# EAGLE design XTIDE-CPLD-5V-v1b (EAGLE 5.07)
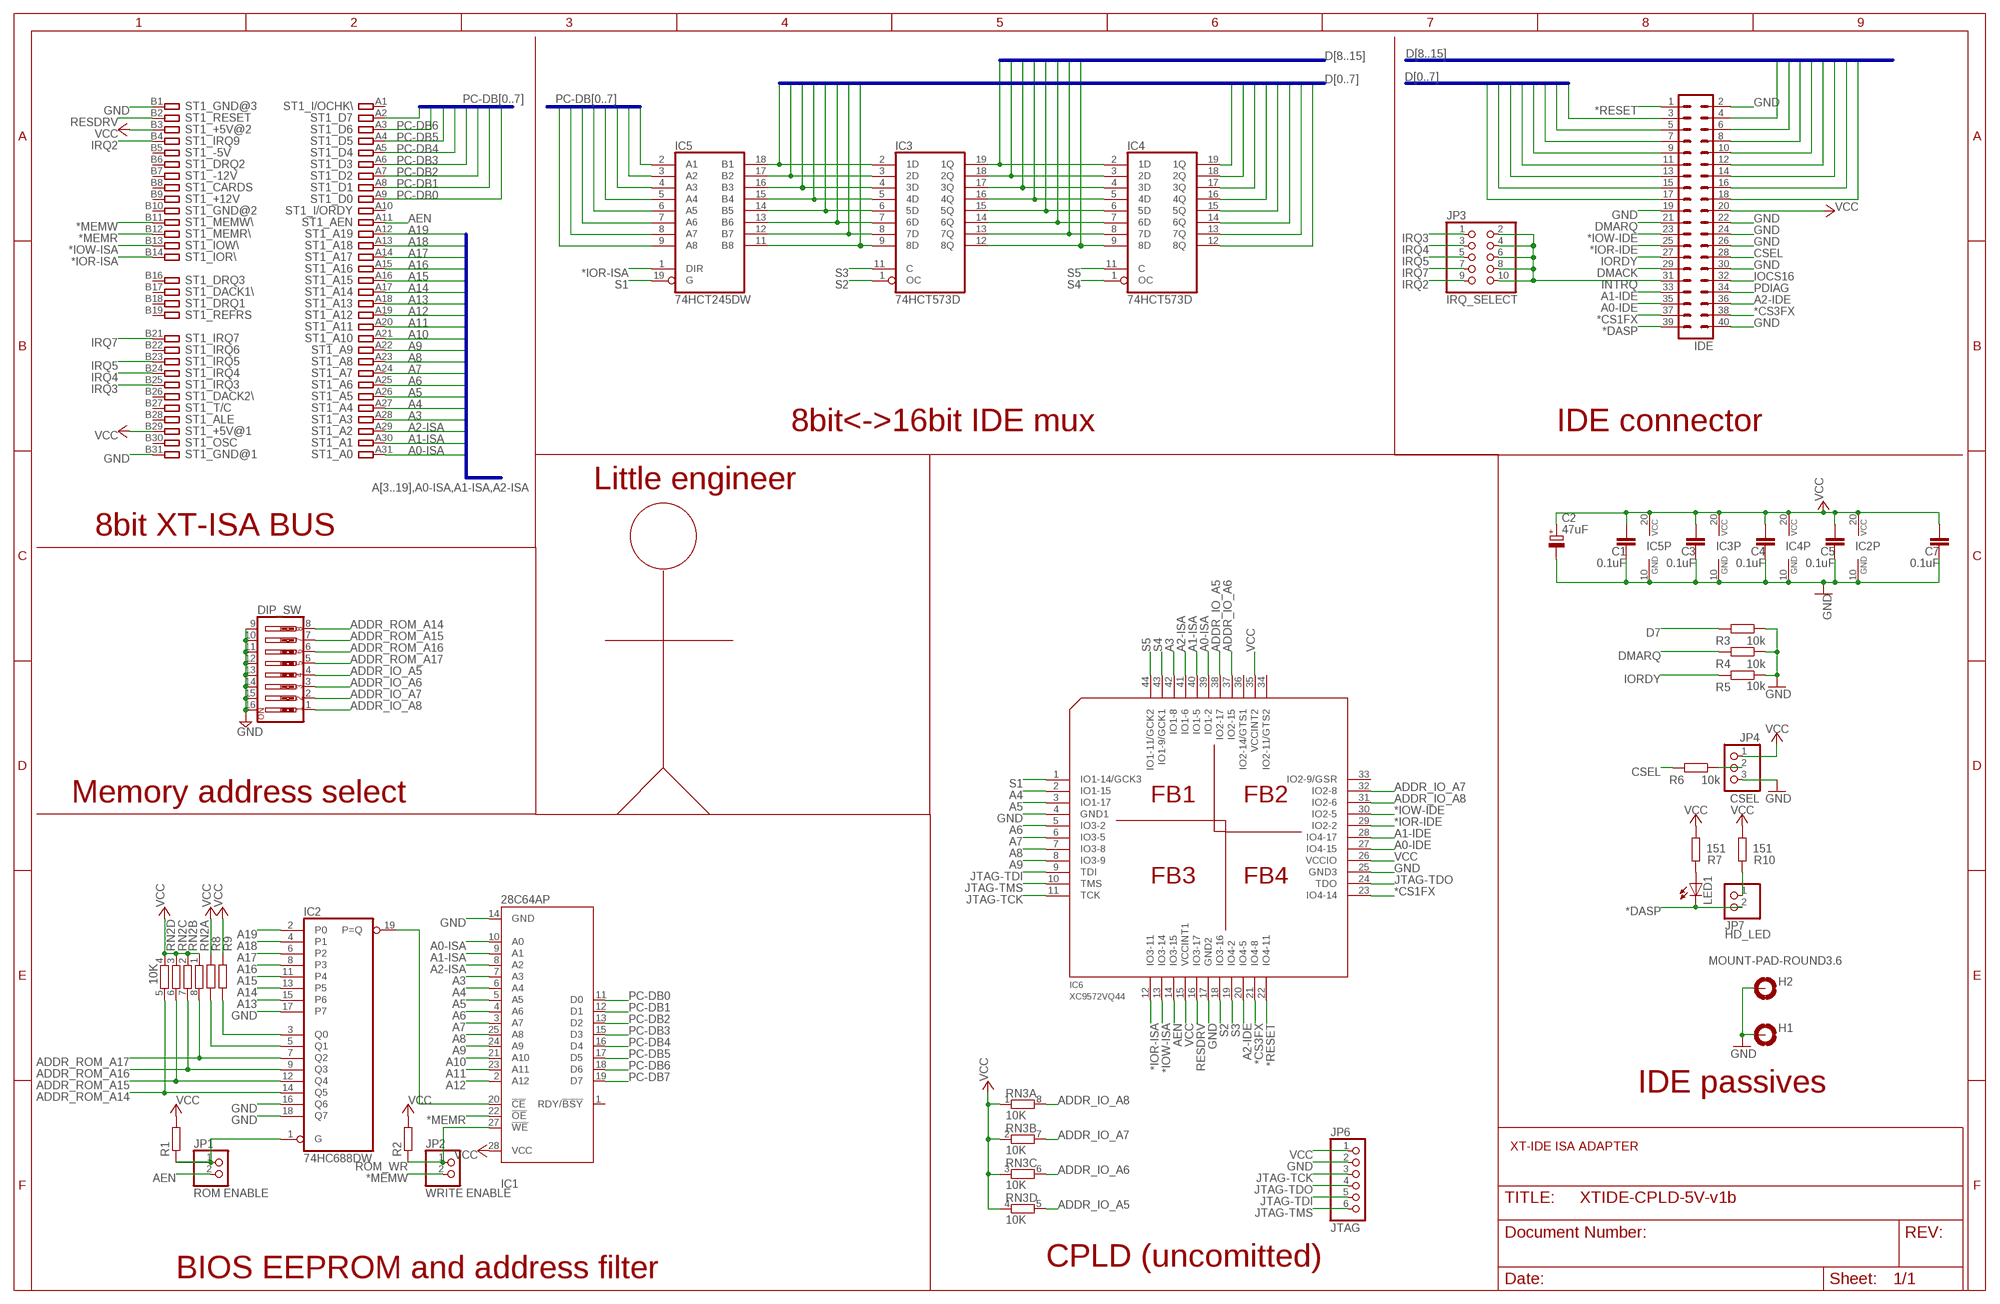
[diagram p0: schematic, sheet 1]

## Parts
C1  0.1uF  C-EUC0603  [C0603]
C2  47uF  CPOL-EUSANYO_SMD_A5  [SANYO-OSCON_SMD_A5]
C3  0.1uF  C-EUC0603  [C0603]
C4  0.1uF  C-EUC0603  [C0603]
C5  0.1uF  C-EUC0603  [C0603]
C7  0.1uF  C-EUC0603  [C0603]
DIP_SW  SW_DIP-8  [EDG-08]
H1  MOUNT-PAD-ROUND3.6  [3,6-PAD]
H2  MOUNT-PAD-ROUND3.6  [3,6-PAD]
IC1  28C64AP  [DIL28-6]
IC2  74HC688DW  [SO20W]
IC3  74HCT573D  [SO20W]
IC4  74HCT573D  [SO20W]
IC5  74HCT245DW  [SO20W]
IC6  XC9572VQ44  [VQ44]
IDE  MA20-2  [MA20-2]
JP1  ROM ENABLE  PINHD-1X02_2.54-S  [1X02-S]
JP2  WRITE ENABLE  PINHD-1X02_2.54-S  [1X02-S]
JP3  IRQ_SELECT  PINHD-2X05_2.54  [2X05]
JP4  CSEL  PINHD-1X03_2.54-S  [1X03-S]
JP6  JTAG  PINHD-1X06_2.54-S  [1X06-S]
JP7  HD_LED  PINHD-1X02_2.54-S  [1X02-S]
LED1  LEDCHIPLED_0805  [CHIPLED_0805]
R1  R-EU_R0603  [R0603]
R2  R-EU_R0603  [R0603]
R3  10k  R-EU_R0603  [R0603]
R4  10k  R-EU_R0603  [R0603]
R5  10k  R-EU_R0603  [R0603]
R6  10k  R-EU_R0603  [R0603]
R7  151  R-EU_R0603  [R0603]
R8  R-EU_R0603  [R0603]
R9  R-EU_R0603  [R0603]
R10  151  R-EU_R0603  [R0603]
RN2  10K  RNETWORK  [RN8P-4R-CRA06S]
RN3  10K  RNETWORK  [RN8P-4R-CRA06S]
ST1  IBM8BIT  [IBM8BIT]

## Nets
*CS1FX: IC6.23(IO4-14) IDE.37
*CS3FX: IC6.21(IO4-8) IDE.38
*DASP: IDE.39 JP7.2 LED1.C
*IOR-IDE: IC6.29(IO2-2) IDE.25
*IOR-ISA: IC5.1(DIR) IC6.12(IO3-11) ST1.B14
*IOW-IDE: IC6.30(IO2-5) IDE.23
*IOW-ISA: IC6.13(IO3-14) ST1.B13
*MEMR: IC1.22(!OE) ST1.B12
*MEMW: JP2.2 ST1.B11
*RESET: IC6.22(IO4-11) IDE.1
A0-IDE: IC6.27(IO4-15) IDE.35
A0-ISA: IC1.10(A0) IC6.39(IO1-2) ST1.A31
A1-IDE: IC6.28(IO4-17) IDE.33
A1-ISA: IC1.9(A1) IC6.40(IO1-5) ST1.A30
A2-IDE: IC6.20(IO4-5) IDE.36
A2-ISA: IC1.8(A2) IC6.41(IO1-6) ST1.A29
A3: IC1.7(A3) IC6.42(IO1-8) ST1.A28
A4: IC1.6(A4) IC6.2(IO1-15) ST1.A27
A5: IC1.5(A5) IC6.3(IO1-17) ST1.A26
A6: IC1.4(A6) IC6.5(IO3-2) ST1.A25
A7: IC1.3(A7) IC6.6(IO3-5) ST1.A24
A8: IC1.25(A8) IC6.7(IO3-8) ST1.A23
A9: IC1.24(A9) IC6.8(IO3-9) ST1.A22
A10: IC1.21(A10) ST1.A21
A11: IC1.23(A11) ST1.A20
A12: IC1.2(A12) ST1.A19
A13: IC2.15(P6) ST1.A18
A14: IC2.13(P5) ST1.A17
A15: IC2.11(P4) ST1.A16
A16: IC2.8(P3) ST1.A15
A17: IC2.6(P2) ST1.A14
A18: IC2.4(P1) ST1.A13
A19: IC2.2(P0) ST1.A12
ADDR_IO_A5: DIP_SW.4 IC6.38(IO2-17) RN3.5
ADDR_IO_A6: DIP_SW.3 IC6.37(IO2-15) RN3.6
ADDR_IO_A7: DIP_SW.2 IC6.32(IO2-8) RN3.7
ADDR_IO_A8: DIP_SW.1 IC6.31(IO2-6) RN3.8
ADDR_ROM_A14: DIP_SW.8 IC2.14(Q5) RN2.5
ADDR_ROM_A15: DIP_SW.7 IC2.12(Q4) RN2.6
ADDR_ROM_A16: DIP_SW.6 IC2.9(Q3) RN2.7
ADDR_ROM_A17: DIP_SW.5 IC2.7(Q2) RN2.8
AEN: IC6.14(IO3-15) JP1.2 ST1.A11
CSEL: IDE.28 R6.2
D0: IC3.2(1D) IC4.19(1Q) IC5.18(B1) IDE.17
D1: IC3.3(2D) IC4.18(2Q) IC5.17(B2) IDE.15
D2: IC3.4(3D) IC4.17(3Q) IC5.16(B3) IDE.13
D3: IC3.5(4D) IC4.16(4Q) IC5.15(B4) IDE.11
D4: IC3.6(5D) IC4.15(5Q) IC5.14(B5) IDE.9
D5: IC3.7(6D) IC4.14(6Q) IC5.13(B6) IDE.7
D6: IC3.8(7D) IC4.13(7Q) IC5.12(B7) IDE.5
D7: IC3.9(8D) IC4.12(8Q) IC5.11(B8) IDE.3 R3.2
D8: IC3.19(1Q) IC4.2(1D) IDE.4
D9: IC3.18(2Q) IC4.3(2D) IDE.6
D10: IC3.17(3Q) IC4.4(3D) IDE.8
D11: IC3.16(4Q) IC4.5(4D) IDE.10
D12: IC3.15(5Q) IC4.6(5D) IDE.12
D13: IC3.14(6Q) IC4.7(6D) IDE.14
D14: IC3.13(7Q) IC4.8(7D) IDE.16
D15: IC3.12(8Q) IC4.9(8D) IDE.18
DMACK: IDE.29
DMARQ: IDE.21 R4.2
GND: C1.1 C2.- C3.1 C4.1 C5.1 C7.1 DIP_SW.9 DIP_SW.10 DIP_SW.11 DIP_SW.12 DIP_SW.13 DIP_SW.14 DIP_SW.15 DIP_SW.16 H1.B3,6(MOUNT) H2.B3,6(MOUNT) IC1.14(GND) IC2.10(GND) IC2.16(Q6) IC2.17(P7) IC2.18(Q7) IC3.10(GND) IC4.10(GND) IC5.10(GND) IC6.4(GND1) IC6.17(GND2) IC6.25(GND3) IDE.2 IDE.19 IDE.22 IDE.24 IDE.26 IDE.30 IDE.40 JP4.3 JP6.2 R3.1 R4.1 R5.1 ST1.B1 ST1.B31
INTRQ: IDE.31 JP3.2 JP3.4 JP3.6 JP3.8 JP3.10
IOCS16: IDE.32
IORDY: IDE.27 R5.2
IRQ2: JP3.9 ST1.B4
IRQ3: JP3.1 ST1.B25
IRQ4: JP3.3 ST1.B24
IRQ5: JP3.5 ST1.B23
IRQ7: JP3.7 ST1.B21
JTAG-TCK: IC6.11(TCK) JP6.3
JTAG-TDI: IC6.9(TDI) JP6.5
JTAG-TDO: IC6.24(TDO) JP6.4
JTAG-TMS: IC6.10(TMS) JP6.6
N$1: IC2.1(G) JP1.1 R1.1
N$2: IC2.3(Q0) R9.1
N$3: IC2.5(Q1) R8.1
N$4: JP4.2 R6.1
N$5: LED1.A R7.2
N$6: JP7.1 R10.2
PC-DB0: IC1.11(D0) IC5.2(A1) ST1.A9
PC-DB1: IC1.12(D1) IC5.3(A2) ST1.A8
PC-DB2: IC1.13(D2) IC5.4(A3) ST1.A7
PC-DB3: IC1.15(D3) IC5.5(A4) ST1.A6
PC-DB4: IC1.16(D4) IC5.6(A5) ST1.A5
PC-DB5: IC1.17(D5) IC5.7(A6) ST1.A4
PC-DB6: IC1.18(D6) IC5.8(A7) ST1.A3
PC-DB7: IC1.19(D7) IC5.9(A8) ST1.A2
PDIAG: IDE.34
RESDRV: IC6.16(IO3-17) ST1.B2
ROM_CS: IC1.20(!CE) IC2.19(P=Q)
ROM_WR: IC1.27(!WE) JP2.1 R2.1
S1: IC5.19(G) IC6.1(IO1-14/GCK3)
S2: IC3.1(OC) IC6.18(IO3-16)
S3: IC3.11(C) IC6.19(IO4-2)
S4: IC4.1(OC) IC6.43(IO1-9/GCK1)
S5: IC4.11(C) IC6.44(IO1-11/GCK2)
VCC: C1.2 C2.+ C3.2 C4.2 C5.2 C7.2 IC1.28(VCC) IC2.20(VCC) IC3.20(VCC) IC4.20(VCC) IC5.20(VCC) IC6.15(VCCINT1) IC6.26(VCCIO) IC6.35(VCCINT2) IDE.20 JP4.1 JP6.1 R1.2 R2.2 R7.1 R8.2 R9.2 R10.1 RN2.1 RN2.2 RN2.3 RN2.4 RN3.1 RN3.2 RN3.3 RN3.4 ST1.B3 ST1.B29
Unconnected: IC1.1(RDY/!BSY) IC6.33(IO2-9/GSR) IC6.34(IO2-11/GTS2) IC6.36(IO2-14/GTS1) ST1.A1 ST1.A10 ST1.B5 ST1.B6 ST1.B7 ST1.B8 ST1.B9 ST1.B10 ST1.B15 ST1.B16 ST1.B17 ST1.B18 ST1.B19 ST1.B20 ST1.B22 ST1.B26 ST1.B27 ST1.B28 ST1.B30

## Buses
D[0..7]
D[8..15]
PC-DB[0..7]
A[3..19],A0-ISA,A1-ISA,A2-ISA

## Notes on the sheet
- 8bit<->16bit IDE mux | IDE connector
- Little engineer
- 8bit XT-ISA BUS
- Memory address select
- IDE passives
- XT-IDE ISA ADAPTER
- CPLD (uncomitted)
- BIOS EEPROM and address filter

## Library data of the parts
C1 C3-C5 C7 = rcl:C-EU: CAPACITOR, European symbol
C2 = rcl:CPOL-EU: POLARIZED CAPACITOR, European symbol
DIP_SW = special:SW_DIP-8: DIP SWITCH
H1 H2 = holes:MOUNT-PAD-ROUND: MOUNTING PAD, round
IC1 = microchip:28*64A: CMOS EEPROM 64 K (8 K x 8), low voltage
IC2 = 74xx-eu:74*688: 8-bit MAGNITUDE/IDENTITY COMPARATOR, totem pole
IC3 IC4 = 74xx-eu:74*573: 8-bit D latch BUS DRIVER
IC5 = 74xx-eu:74*245: Octal BUS TRANSCEIVER, 3-state
IC6 = dp_devices:XC9572
IDE = con-lstb:MA20-2: PIN HEADER
JP1 JP2 JP7 = pinhead-2:PINHD-1X02: PIN HEADER
JP3 = pinhead-2:PINHD-2X05: PIN HEADER
JP4 = pinhead-2:PINHD-1X03: PIN HEADER
JP6 = pinhead-2:PINHD-1X06: PIN HEADER
LED1 = led:LED: LED OSRAM: - CHIPLED LG R971, LG N971, LY N971, LG Q971, LY Q971, LO R971, LY R971 LH N974, LH R974 LS Q976, LO Q976, LY Q976 LO Q996 - Hyper CHIPLED LW Q18S LB Q993, LB Q99A, LB R99A - SideLED LS A670, LO A670, LY A670, LG A670, LP A670 LB A673, LV A673, LT A673, LW A673 LH A674 LY A675 LS A676, LA A676, LO A676, LY A676, LW A676 LS A679, LY A679, LG A679 - Hyper Micro SIDELED® LS Y876, LA Y876, LO Y876, LY Y876 LT Y87S - SmartLED LW L88C, LW L88S LB L89C, LB L89S, LG L890 LS L89K, LO L89K, LY L89K LS L896, LA L896, LO L896, LY L896 - TOPLED LS T670, LO T670, LY T670, LG T670, LP T670 LSG T670, LSP T670, LSY T670, LOP T670, LYG T670 LG T671, LOG T671, LSG T671 LB T673, LV T673, LT T673, LW T673 LH T674 LS T676, LA T676, LO T676, LY T676, LB T676, LH T676, LSB T676, LW T676 LB T67C, LV T67C, LT T67C, LS T67K, LO T67K, LY T67K, LW E67C LS E67B, LA E67B, LO E67B, LY E67B, LB E67C, LV E67C, LT E67C LW T67C LS T679, LY T679, LG T679 LS T770, LO T770, LY T770, LG T770, LP T770 LB T773, LV T773, LT T773, LW T773 LH T774 LS E675, LA E675, LY E675, LS T675 LS T776, LA T776, LO T776, LY T776, LB T776 LHGB T686 LT T68C, LB T68C - Hyper Mini TOPLED® LB M676 - Mini TOPLED Santana® LG M470 LS M47K, LO M47K, LY M47K Source: http://www.osram.convergy.de LUXEON: - LUMILED® LXK2-PW12-R00, LXK2-PW12-S00, LXK2-PW14-U00, LXK2-PW14-V00 LXK2-PM12-R00, LXK2-PM12-S00, LXK2-PM14-U00 LXK2-PE12-Q00, LXK2-PE12-R00, LXK2-PE12-S00, LXK2-PE14-T00, LXK2-PE14-U00 LXK2-PB12-K00, LXK2-PB12-L00, LXK2-PB12-M00, LXK2-PB14-N00, LXK2-PB14-P00, LXK2-PB14-Q00 LXK2-PR12-L00, LXK2-PR12-M00, LXK2-PR14-Q00, LXK2-PR14-R00 LXK2-PD12-Q00, LXK2-PD12-R00, LXK2-PD12-S00 LXK2-PH12-R00, LXK2-PH12-S00 LXK2-PL12-P00, LXK2-PL12-Q00, LXK2-PL12-R00 Source: www.luxeon.com KINGBRIGHT: KA-3528ASYC Source: www.kingbright.com
R1-R10 = rcl:R-EU_: RESISTOR, European symbol
RN2 RN3 = dp_devices:RNETWORK: 4 Resistor Array 0603
ST1 = con-pc:IBM8BIT: 8-bit CARD IBM/PC-AT

## Board
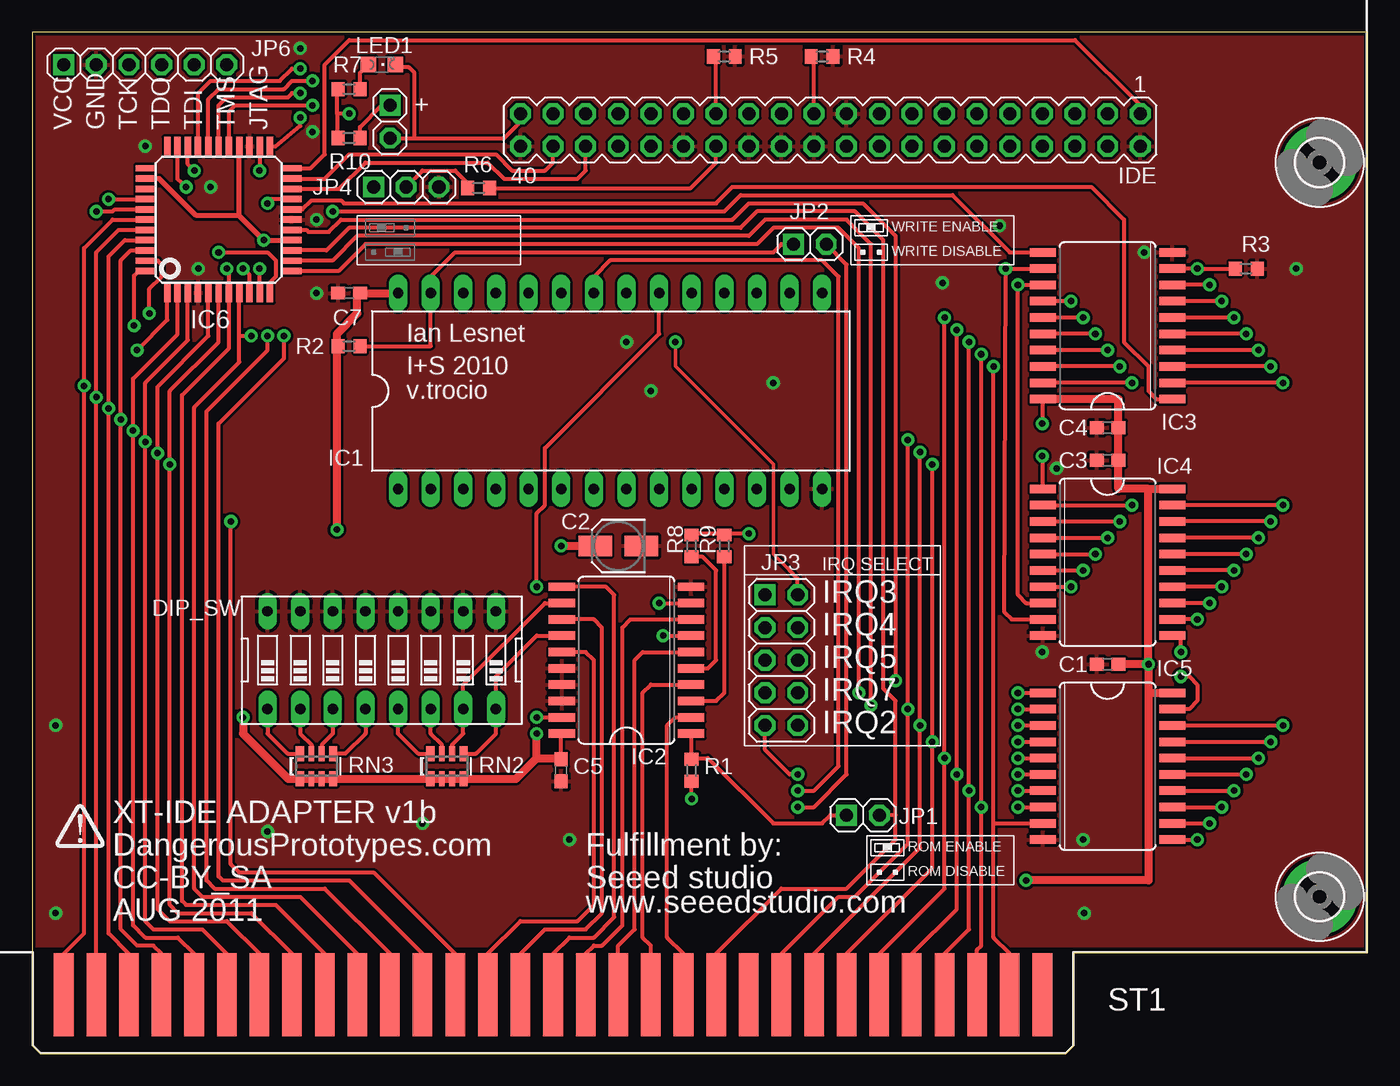
[diagram p1: board, top side]
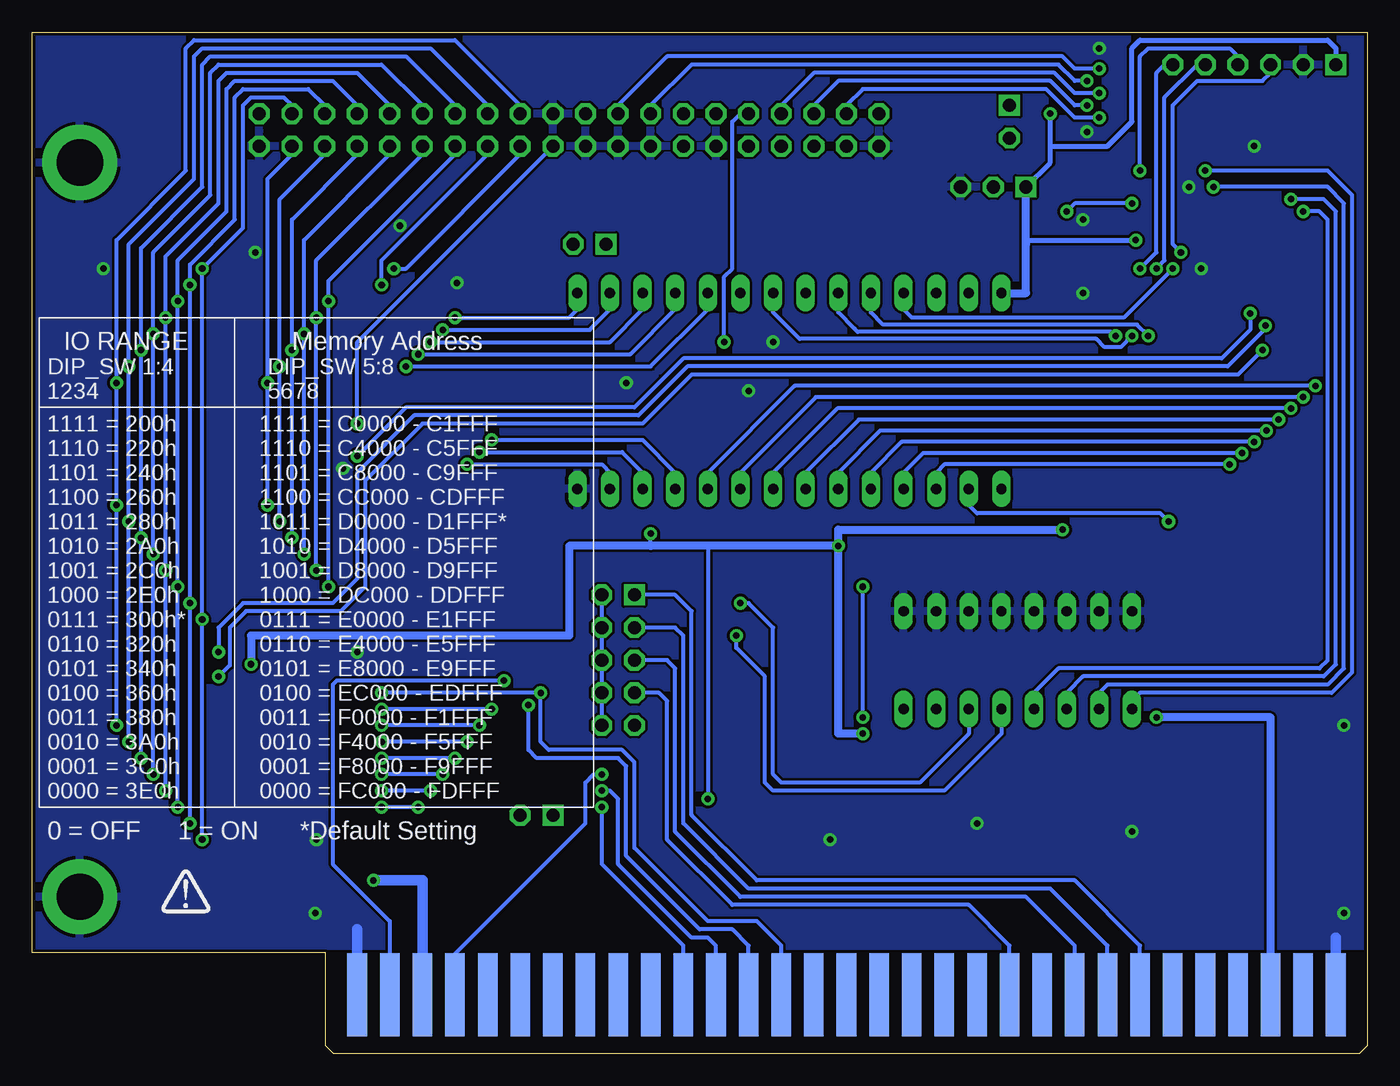
[diagram p2: board, bottom side, seen from below]

Size 103.97 x 79.52 mm. Coordinates in mm from the lower left corner, seen from the top.
Outline: 0,0.79 0,0.63 0.63,0 80.49,0 81.12,0.63 81.12,7.86 103.97,7.86 103.97,79.52 0,79.52 0,0.79
Copper layers (1*16): Top 0.035mm / dielectric 1.5mm / Bottom 0.035mm
Design rules "SparkFun": minimum track width 8mil, minimum drill 20mil, track to track 8mil, track to pad 8mil, pad to pad 8mil, via to via 8mil, smd to smd 8mil, copper to edge 10mil, drill to drill 8mil, minimum pad ring 12mil, minimum via ring 10mil, stop-mask expansion 4mil, vias tented up to drill 25mil, thermal gap 10mil

### Footprints (pad centres in the part's own frame; a part is rotated, then mirrored left to right if it is on the bottom)
C0603 = smd 1.1 x 1: 1 -0.85,0; 2 0.85,0
SANYO-OSCON_SMD_A5 = smd 2.6 x 1.6: + 1.8,0; - -1.8,0
EDG-08 = drill 0.813 long: 1 -8.89,-3.81; 2 -6.35,-3.81; 3 -3.81,-3.81; 4 -1.27,-3.81; 5 1.27,-3.81; 6 3.81,-3.81; 7 6.35,-3.81; 8 8.89,-3.81; 9 8.89,3.81; 10 6.35,3.81; 11 3.81,3.81; 12 1.27,3.81; 13 -1.27,3.81; 14 -3.81,3.81; 15 -6.35,3.81; 16 -8.89,3.81
3,6-PAD = drill 3.6 pad 5.842 round: B3,6 0,0
DIL28-6 = drill 0.813 long: 1 -16.51,-7.62; 2 -13.97,-7.62; 3 -11.43,-7.62; 4 -8.89,-7.62; 5 -6.35,-7.62; 6 -3.81,-7.62; 7 -1.27,-7.62; 8 1.27,-7.62; 9 3.81,-7.62; 10 6.35,-7.62; 11 8.89,-7.62; 12 11.43,-7.62; 13 13.97,-7.62; 14 16.51,-7.62; 15 16.51,7.62; 16 13.97,7.62; 17 11.43,7.62; 18 8.89,7.62; 19 6.35,7.62; 20 3.81,7.62; 21 1.27,7.62; 22 -1.27,7.62; 23 -3.81,7.62; 24 -6.35,7.62; 25 -8.89,7.62; 26 -11.43,7.62; 27 -13.97,7.62; 28 -16.51,7.62
SO20W = smd 0.66 x 2.032: 1 -5.715,-5.029; 2 -4.445,-5.029; 3 -3.175,-5.029; 4 -1.905,-5.029; 5 -0.635,-5.029; 6 0.635,-5.029; 7 1.905,-5.029; 8 3.175,-5.029; 9 4.445,-5.029; 10 5.715,-5.029; 11 5.715,5.029; 12 4.445,5.029; 13 3.175,5.029; 14 1.905,5.029; 15 0.635,5.029; 16 -0.635,5.029; 17 -1.905,5.029; 18 -3.175,5.029; 19 -4.445,5.029; 20 -5.715,5.029
VQ44 = smd 1.5 x 0.5: 1 -5.7,4; 2 -5.7,3.2; 3 -5.7,2.4; 4 -5.7,1.6; 5 -5.7,0.8; 6 -5.7,0; 7 -5.7,-0.8; 8 -5.7,-1.6; 9 -5.7,-2.4; 10 -5.7,-3.2; 11 -5.7,-4; 23 5.7,-4; 24 5.7,-3.2; 25 5.7,-2.4; 26 5.7,-1.6; 27 5.7,-0.8; 28 5.7,0; 29 5.7,0.8; 30 5.7,1.6; 31 5.7,2.4; 32 5.7,3.2; 33 5.7,4 | smd 0.5 x 1.5: 12 -4,-5.7; 13 -3.2,-5.7; 14 -2.4,-5.7; 15 -1.6,-5.7; 16 -0.8,-5.7; 17 0,-5.7; 18 0.8,-5.7; 19 1.6,-5.7; 20 2.4,-5.7; 21 3.2,-5.7; 22 4,-5.7; 34 4,5.7; 35 3.2,5.7; 36 2.4,5.7; 37 1.6,5.7; 38 0.8,5.7; 39 0,5.7; 40 -0.8,5.7; 41 -1.6,5.7; 42 -2.4,5.7; 43 -3.2,5.7; 44 -4,5.7
MA20-2 = drill 1.016 octagon: 1 -24.13,-1.27; 2 -24.13,1.27; 3 -21.59,-1.27; 4 -21.59,1.27; 5 -19.05,-1.27; 6 -19.05,1.27; 7 -16.51,-1.27; 8 -16.51,1.27; 9 -13.97,-1.27; 10 -13.97,1.27; 11 -11.43,-1.27; 12 -11.43,1.27; 13 -8.89,-1.27; 14 -8.89,1.27; 15 -6.35,-1.27; 16 -6.35,1.27; 17 -3.81,-1.27; 18 -3.81,1.27; 19 -1.27,-1.27; 20 -1.27,1.27; 21 1.27,-1.27; 22 1.27,1.27; 23 3.81,-1.27; 24 3.81,1.27; 25 6.35,-1.27; 26 6.35,1.27; 27 8.89,-1.27; 28 8.89,1.27; 29 11.43,-1.27; 30 11.43,1.27; 31 13.97,-1.27; 32 13.97,1.27; 33 16.51,-1.27; 34 16.51,1.27; 35 19.05,-1.27; 36 19.05,1.27; 37 21.59,-1.27; 38 21.59,1.27; 39 24.13,-1.27; 40 24.13,1.27
1X02-S = drill 1.016 square: 1 -1.27,0 | drill 1.016 octagon: 2 1.27,0
2X05 = drill 1.016 square: 1 -5.08,-1.27 | drill 1.016 octagon: 2 -5.08,1.27; 3 -2.54,-1.27; 4 -2.54,1.27; 5 0,-1.27; 6 0,1.27; 7 2.54,-1.27; 8 2.54,1.27; 9 5.08,-1.27; 10 5.08,1.27
1X03-S = drill 1.016 square: 1 -2.54,0 | drill 1.016 octagon: 2 0,0; 3 2.54,0
1X06-S = drill 1.016 square: 1 -6.35,0 | drill 1.016 octagon: 2 -3.81,0; 3 -1.27,0; 4 1.27,0; 5 3.81,0; 6 6.35,0
CHIPLED_0805 = smd 1.2 x 1.2: A 0,-1.05; C 0,1.05
R0603 = smd 1 x 1.1: 1 -0.85,0; 2 0.85,0
RN8P-4R-CRA06S = smd 0.63 x 1.15: 1 -1.295,-0.975; 4 1.295,-0.975; 5 1.295,0.975; 8 -1.295,0.975 | smd 0.44 x 1.15: 2 -0.4,-0.975; 3 0.4,-0.975; 6 0.4,0.975; 7 -0.4,0.975
IBM8BIT = smd 1.524 x 6.477: A1 -25.4,5.08; A2 -27.94,5.08; A3 -30.48,5.08; A4 -33.02,5.08; A5 -35.56,5.08; A6 -38.1,5.08; A7 -40.64,5.08; A8 -43.18,5.08; A9 -45.72,5.08; A10 -48.26,5.08; A11 -50.8,5.08; A12 -53.34,5.08; A13 -55.88,5.08; A14 -58.42,5.08; A15 -60.96,5.08; A16 -63.5,5.08; A17 -66.04,5.08; A18 -68.58,5.08; A19 -71.12,5.08; A20 -73.66,5.08; A21 -76.2,5.08; A22 -78.74,5.08; A23 -81.28,5.08; A24 -83.82,5.08; A25 -86.36,5.08; A26 -88.9,5.08; A27 -91.44,5.08; A28 -93.98,5.08; A29 -96.52,5.08; A30 -99.06,5.08; A31 -101.6,5.08 | smd 1.524 x 6.477 bottom: B1 -25.4,5.08; B2 -27.94,5.08; B3 -30.48,5.08; B4 -33.02,5.08; B5 -35.56,5.08; B6 -38.1,5.08; B7 -40.64,5.08; B8 -43.18,5.08; B9 -45.72,5.08; B10 -48.26,5.08; B11 -50.8,5.08; B12 -53.34,5.08; B13 -55.88,5.08; B14 -58.42,5.08; B15 -60.96,5.08; B16 -63.5,5.08; B17 -66.04,5.08; B18 -68.58,5.08; B19 -71.12,5.08; B20 -73.66,5.08; B21 -76.2,5.08; B22 -78.74,5.08; B23 -81.28,5.08; B24 -83.82,5.08; B25 -86.36,5.08; B26 -88.9,5.08; B27 -91.44,5.08; B28 -93.98,5.08; B29 -96.52,5.08; B30 -99.06,5.08; B31 -101.6,5.08

### Placement (x,y rotation side)
C1  83.74,30.32 0 top
C2  45.64,39.53 180 top
C3  83.74,46.2 0 top
C4  83.74,48.74 0 top
C5  41.2,22.07 90 top
C7  24.69,59.21 0 top
DIP_SW  27.23,30.64 0 top
H1  100.25,12.22 0 top
H2  100.25,69.37 0 top
IC1  45.01,51.59 0 top
IC2  46.28,30.64 90 top
IC3  83.74,56.67 90 top
IC4  83.74,38.26 270 top
IC5  83.74,22.38 270 top
IC6  14.53,64.93 90 top
IDE  62.15,71.91 180 top
JP1  64.69,18.57 0 top
JP2  60.56,63.02 0 top
JP3  58.34,30.64 270 top
JP4  29.13,67.47 0 top
JP6  8.81,76.99 0 top
JP7  27.86,72.55 270 top
LED1  27.23,76.99 270 top
R1  51.36,22.07 270 top
R2  24.69,55.09 180 top
R3  94.54,61.12 180 top
R4  61.52,77.63 180 top
R5  53.9,77.63 180 top
R6  34.77,67.39 0 top
R7  24.69,75.09 0 top
R8  51.36,39.53 90 top
R9  53.9,39.53 90 top
R10  24.69,71.28 0 top
RN2  32.31,22.38 0 top
RN3  22.15,22.38 0 top
ST1  104.06,-0.48 0 top
U$1  [DP-LOGO_TOP]  1.83,16.03 0 top
U$2  [DP-LOGO-BOTTOM]  90.09,10.95 0 top
U$3  [JUMP2_DESC_OFF]  65.33,62.39 0 top
U$4  [JUMP3_DESC_LEFT]  27.86,64.29 0 top
U$5  [JUMP3_DESC_RIGHT]  27.86,62.39 0 top
U$6  [JUMP2_DESC_ON]  66.6,16.03 0 top
U$7  [JUMP2_DESC_OFF]  66.6,14.13 0 top
WRITE_ENABLE  [JUMP2_DESC_ON]  65.33,64.29 0 top

### Tracks (layer width: path | path; a pad name or v marks a point on that pad's centre or on a via)
*CS1FX  (via drill 0.51)
  Top 0.305: v20.88,72.87 20.88,72.23 18.96,70.63 IC6.23
  Bottom 0.305: IDE.37 40.56,73.82 39.29,75.09 25,75.09 22.78,72.87 v20.88,72.87
*CS3FX
  Top 0.305: IDE.38 40.56,69.37 39.93,68.74 37.39,68.74 36.12,70.01 24.69,70.01 22.78,68.1 20.88,68.1 20.85,68.13 IC6.21
*DASP
  Top 0.305: IDE.39 38.02,72.55 36.75,71.28 29.77,71.28 | JP7.2 29.77,71.28 | LED1.C 28.5,76.77 29.35,76.77 29.77,76.36 29.77,71.28
*IOR-IDE  (via drill 0.51)
  Top 0.305: v21.83,75.72 20.24,75.72 19.61,75.09 14.53,75.09 13.73,74.29 IC6.29
  Bottom 0.305: v21.83,75.72 22.78,75.72 24.05,76.99 52.63,76.99 55.8,73.82 IDE.25
*IOR-ISA  (via drill 0.51)
  Top 0.305: v76.76,28.1 IC5.1 | v64.37,28.1 64.37,62.71 62.79,64.29 57.71,64.29 56.44,63.02 25.96,63.02 23.86,60.93 IC6.12
  Bottom 0.305: v76.76,28.1 v64.37,28.1 64.37,24.29 63.74,23.65 58.02,23.65 57.07,22.7 57.07,16.03 51.36,10.32 47.55,10.32 45.64,8.41 ST1.B14
*IOW-IDE  (via drill 0.51)
  Top 0.305: v20.88,76.68 20.24,76.68 19.29,75.72 13.89,75.72 12.93,74.76 IC6.30
  Bottom 0.305: v20.88,76.68 22.78,76.68 23.73,77.63 54.53,77.63 58.34,73.82 IDE.23
*IOW-ISA  (via drill 0.51)
  Top 0.305: v65.33,27.15 65.33,63.02 63.42,64.93 57.07,64.93 55.8,63.66 25.32,63.66 23.39,61.73 IC6.13
  Bottom 0.305: v65.33,27.15 65.33,23.65 64.69,23.02 58.34,23.02 57.71,22.38 57.71,15.4 51.99,9.68 49.45,9.68 48.18,8.41 ST1.B13
*MEMR  (via drill 0.51)
  Top 0.305: IC1.22 43.74,60.48 45.01,61.75 61.52,61.75 62.79,60.48 62.79,22.38 60.88,20.48 v59.61,20.48
  Bottom 0.305: v59.61,20.48 58.98,20.48 58.34,19.84 58.34,14.76 52.63,9.05 51.36,9.05 50.72,8.41 ST1.B12
*MEMW  (via drill 0.51)
  Top 0.305: v59.61,19.21 60.88,19.21 63.42,21.75 63.42,61.44 JP2.2
  Bottom 0.305: v59.61,19.21 59.61,14.76 53.26,8.41 ST1.B11
*RESET
  Top 0.305: IDE.1 86.28,73.82 81.2,78.9 24.69,78.9 22.78,76.99 22.78,70.01 21.7,68.93 IC6.22
A0-IDE  (via drill 0.51)
  Top 0.305: v21.83,73.82 15.8,73.82 15.33,73.35 IC6.27
  Bottom 0.305: v21.83,73.82 22.78,73.82 24.69,75.72 41.2,75.72 43.1,73.82 IDE.35
A0-ISA  (via drill 0.51)
  Top 0.305: ST1.A31 2.46,7.78 4.05,9.37 v4.05,51.99 4.05,62.71 6.27,64.93 IC6.39
  Bottom 0.305: IC1.10 51.36,45.24 44.61,51.99 v4.05,51.99
A1-IDE  (via drill 0.51)
  Top 0.305: v20.88,74.77 20.24,74.77 19.92,74.45 15.16,74.45 14.53,73.82 IC6.28
  Bottom 0.305: v20.88,74.77 22.78,74.77 24.37,76.36 43.1,76.36 45.64,73.82 IDE.33
A1-ISA  (via drill 0.51)
  Top 0.305: ST1.A30 v5,51.12 5,62.39 6.74,64.13 IC6.40
  Bottom 0.305: IC1.9 48.82,45.24 42.94,51.12 v5,51.12
A2-IDE
  Top 0.305: IDE.36 43.1,68.74 42.47,68.1 36.75,68.1 35.48,69.37 25.96,69.37 23.91,67.33 IC6.20
A2-ISA  (via drill 0.51)
  Top 0.305: ST1.A29 7.54,7.78 5.95,9.37 v5.95,50.24 5.95,62.07 7.21,63.33 IC6.41
  Bottom 0.305: IC1.8 46.28,45.24 41.27,50.24 v5.95,50.24
A3  (via drill 0.51)
  Top 0.305: ST1.A28 10.08,7.78 9.45,8.41 8.18,8.41 6.91,9.68 v6.91,49.37 6.91,61.75 7.68,62.53 IC6.42
  Bottom 0.305: IC1.7 43.74,45.24 39.61,49.37 v6.91,49.37
A4  (via drill 0.51)
  Top 0.305: ST1.A27 12.62,7.78 11.35,9.05 8.81,9.05 7.86,10 v7.86,48.5 7.86,52.55 11.33,56.01 IC6.2
  Bottom 0.305: IC1.6 41.2,45.24 37.94,48.5 v7.86,48.5
A5  (via drill 0.51)
  Top 0.305: ST1.A26 15.16,7.78 13.26,9.68 9.45,9.68 8.81,10.32 v8.81,47.62 8.81,52.23 12.13,55.54 IC6.3
  Bottom 0.305: IC1.5 38.66,45.24 36.27,47.62 v8.81,47.62
A6  (via drill 0.51)
  Top 0.305: ST1.A25 17.7,7.78 15.16,10.32 10.72,10.32 9.76,11.27 v9.76,46.75 9.76,51.91 13.73,55.87 IC6.5
  Bottom 0.305: IC1.4 36.12,45.24 34.61,46.75 v9.76,46.75
A7  (via drill 0.51)
  Top 0.305: ST1.A24 20.24,7.78 17.07,10.95 11.35,10.95 10.72,11.59 v10.72,45.88 10.72,51.59 14.53,55.4 IC6.6
  Bottom 0.305: 33.58,45.24 IC1.3 | 33.58,45.24 | 33.58,45.24 32.94,45.88 v10.72,45.88
A8  (via drill 0.51)
  Top 0.305: ST1.A23 22.78,7.78 18.97,11.59 11.99,11.59 11.67,11.91 11.67,51.28 15.33,54.93 IC6.7 15.33,60.95 v15.16,61.12
  Bottom 0.305: IC1.25 36.12,57.94 35.48,57.31 18.97,57.31 v15.16,61.12
A9  (via drill 0.51)
  Top 0.305: ST1.A22 25.32,7.78 20.88,12.22 13.26,12.22 12.62,12.86 12.62,50.32 16.13,53.83 16.13,55.8 | 16.13,55.8 IC6.8 | v17.07,55.88 16.2,55.88 16.13,55.8
  Bottom 0.305: IC1.24 38.66,57.71 37.7,56.75 17.94,56.75 v17.07,55.88
A10  (via drill 0.51)
  Top 0.305: ST1.A21 27.86,7.78 22.78,12.86 14.21,12.86 13.57,13.49 13.57,50.01 18.34,54.77 v18.34,55.88
  Bottom 0.305: IC1.21 46.28,57.71 44.29,55.72 | 44.29,55.72 | 44.29,55.72 44.21,55.64 21.11,55.64 20.48,55.01 19.21,55.01 v18.34,55.88 | v18.34,55.88
A11  (via drill 0.51)
  Top 0.305: v19.61,55.88 19.61,54.13 14.53,49.05 14.53,13.81 14.84,13.49 24.69,13.49 30.4,7.78 ST1.A20
  Bottom 0.305: IC1.23 41.2,57.71 39.93,56.44 | 39.93,56.44 | 39.77,56.28 39.93,56.44 | 39.77,56.28 | 39.77,56.28 39.69,56.2 19.92,56.2 v19.61,55.88
A12  (via drill 0.51)
  Top 0.305: ST1.A19 32.94,7.78 26.59,14.13 16.11,14.13 15.48,14.76 v15.48,41.43
  Bottom 0.305: IC1.2 31.04,42.7 30.4,42.07 16.11,42.07 v15.48,41.43
A13
  Top 0.305: IC2.15 43.1,31.27 43.74,30.64 43.74,11.59 42.47,10.32 38.02,10.32 35.48,7.78 ST1.A18
A14
  Top 0.305: IC2.13 43.74,33.81 44.37,33.18 44.37,10.95 43.1,9.68 39.93,9.68 38.02,7.78 ST1.A17
A15
  Top 0.305: IC2.11 44.69,36.35 45.32,35.72 45.32,10.64 43.74,9.05 41.83,9.05 40.56,7.78 ST1.A16
A16
  Top 0.305: IC2.8 46.59,33.81 45.96,33.18 45.96,10 44.37,8.41 43.74,8.41 43.1,7.78 ST1.A15
A17
  Top 0.305: IC2.6 47.55,31.27 46.91,30.64 46.91,9.68 45.64,8.41 ST1.A14
A18
  Top 0.305: IC2.4 48.18,28.73 47.55,28.1 47.55,9.05 48.18,8.41 ST1.A13
A19
  Top 0.305: IC2.2 50.09,26.19 49.45,25.56 49.45,9.05 50.72,7.78 ST1.A12
ADDR_IO_A5  (via drill 0.51)
  Top 0.305: v5,65.56 6.27,65.56 6.44,65.73 IC6.38 | RN3.5 24.39,23.36 25.96,24.92 DIP_SW.4
  Bottom 0.305: DIP_SW.4 25.96,28.1 24.05,30 3.73,30 3.1,30.64 3.1,64.93 3.73,65.56 v5,65.56
ADDR_IO_A6  (via drill 0.51)
  Top 0.305: 5.97,66.53 v5.95,66.52 5.95,66.53 IC6.37 | RN3.6 22.55,24.05 23.42,24.92 DIP_SW.3
  Bottom 0.305: DIP_SW.3 23.42,28.1 22.15,29.37 3.41,29.37 2.46,30.32 2.46,65.56 3.41,66.52 v5.95,66.52
ADDR_IO_A7  (via drill 0.51)
  Top 0.305: v11.99,67.47 11.33,68.08 IC6.32 | RN3.7 21.75,24.05 20.88,24.92 DIP_SW.2
  Bottom 0.305: DIP_SW.2 20.88,28.1 20.24,28.73 3.1,28.73 1.83,30 1.83,66.2 3.1,67.47 v11.99,67.47
ADDR_IO_A8  (via drill 0.51)
  Top 0.305: v12.62,68.74 12.13,69.23 IC6.31 | RN3.8 19.9,23.36 18.34,24.92 DIP_SW.1
  Bottom 0.305: DIP_SW.1 18.34,27.46 17.7,28.1 2.78,28.1 1.19,29.69 1.19,66.83 3.1,68.74 v12.62,68.74
ADDR_ROM_A14
  Top 0.305: IC2.14 39.29,32.54 36.12,29.37 DIP_SW.8 | DIP_SW.8 36.12,25.56 | RN2.5 34.55,23.36 36.12,24.92 DIP_SW.8
ADDR_ROM_A15
  Top 0.305: IC2.12 39.93,35.08 33.58,28.73 DIP_SW.7 33.58,26.19 33.58,25.56 33.58,24.92 32.71,24.05 RN2.6
ADDR_ROM_A16  (via drill 0.51)
  Top 0.305: v48.82,35.08 IC2.9 | RN2.7 31.91,24.05 31.04,24.92 DIP_SW.6
  Bottom 0.305: v48.82,35.08 48.18,35.08 46.28,33.18 46.28,21.75 45.64,21.11 34.85,21.11 31.04,24.92 DIP_SW.6
ADDR_ROM_A17  (via drill 0.51)
  Top 0.305: v49.13,32.54 IC2.7 | RN2.8 30.06,23.36 28.5,24.92 DIP_SW.5
  Bottom 0.305: v49.13,32.54 49.13,31.59 46.91,29.37 46.91,21.11 46.28,20.48 32.94,20.48 28.5,24.92 DIP_SW.5
AEN
  Top 0.305: 67.23,18.57 67.23,27.46 66.28,28.42 66.28,63.34 64.06,65.56 56.44,65.56 55.17,64.29 24.69,64.29 22.92,62.53 IC6.14 | 67.23,18.57 JP1.2 | ST1.A11 53.26,7.78 58.34,12.86 63.42,12.86 67.23,16.67 67.23,18.57
CSEL
  Top 0.305: R6.2 51.28,67.39 53.26,69.37 IDE.28
D0  (via drill 0.51)
  Top 0.305: IC5.18 v97.39,25.56 | v97.39,42.7 IC4.19 | v97.39,52.23 IC3.2
  Bottom 0.305: v97.39,25.56 v97.39,42.7 v97.39,52.23 97.39,63.34 92,68.74 92,78.26 91.36,78.9 71.04,78.9 65.96,73.82 IDE.17
D1  (via drill 0.51)
  Top 0.305: IC5.17 v96.44,24.29 | v96.44,41.43 IC4.18 | v96.44,53.5 IC3.3
  Bottom 0.305: v96.44,24.29 v96.44,41.43 v96.44,53.5 96.44,63.02 91.36,68.1 91.36,77.63 90.73,78.26 72.95,78.26 68.5,73.82 IDE.15
D2  (via drill 0.51)
  Top 0.305: IC5.16 v95.49,23.02 | v95.49,40.16 IC4.17 | v95.49,54.77 IC3.4
  Bottom 0.305: v95.49,23.02 v95.49,40.16 v95.49,54.77 95.49,62.71 90.73,67.47 90.73,76.99 90.09,77.63 74.85,77.63 71.04,73.82 IDE.13
D3  (via drill 0.51)
  Top 0.305: IC5.15 v94.54,21.75 | v94.54,38.89 IC4.16 | v94.54,56.04 IC3.5
  Bottom 0.305: v94.54,21.75 v94.54,38.89 v94.54,56.04 94.54,62.39 90.09,66.83 90.09,76.36 89.46,76.99 76.76,76.99 73.58,73.82 IDE.11
D4  (via drill 0.51)
  Top 0.305: IC5.14 v93.58,20.48 | v93.58,37.62 IC4.15 | v93.58,57.31 IC3.6
  Bottom 0.305: v93.58,20.48 v93.58,37.62 v93.58,57.31 93.58,62.07 89.46,66.2 89.46,75.72 88.82,76.36 78.66,76.36 76.12,73.82 IDE.9
D5  (via drill 0.51)
  Top 0.305: IC5.13 v92.63,19.21 | v92.63,36.35 IC4.14 | v92.63,58.58 IC3.7
  Bottom 0.305: v92.63,19.21 v92.63,36.35 v92.63,58.58 92.63,61.75 88.82,65.56 88.82,75.09 88.19,75.72 80.57,75.72 78.66,73.82 IDE.7
D6  (via drill 0.51)
  Top 0.305: IC5.12 v91.68,17.94 | v91.68,35.08 IC4.13 | v91.68,59.85 IC3.8
  Bottom 0.305: v91.68,17.94 v91.68,35.08 v91.68,59.85 91.68,61.44 88.19,64.93 88.19,74.45 87.55,75.09 82.47,75.09 81.2,73.82 IDE.5
D7  (via drill 0.51)
  Top 0.305: IC5.11 v90.73,16.67 | v90.73,33.81 IC4.12 | IC3.9 v90.73,61.12 R3.2
  Bottom 0.305: v90.73,16.67 v90.73,33.81 v90.73,61.12 87.55,64.29 87.55,73.82 86.92,74.45 84.38,74.45 83.74,73.82 IDE.3
D8  (via drill 0.51)
  Top 0.305: IC4.2 v85.65,42.7 | v85.65,52.23 IC3.19
  Bottom 0.305: v85.65,42.7 v85.65,52.23 85.65,68.1 83.74,70.01 IDE.4
D9  (via drill 0.51)
  Top 0.305: IC4.3 v84.69,41.43 | v84.69,53.5 IC3.18
  Bottom 0.305: v84.69,41.43 v84.69,53.5 84.69,66.52 81.2,70.01 IDE.6
D10  (via drill 0.51)
  Top 0.305: IC4.4 v83.74,40.16 | v83.74,54.77 IC3.17
  Bottom 0.305: v83.74,40.16 v83.74,54.77 83.74,64.93 78.66,70.01 IDE.8
D11  (via drill 0.51)
  Top 0.305: IC4.5 v82.79,38.89 | v82.79,56.04 IC3.16
  Bottom 0.305: v82.79,38.89 v82.79,56.04 82.79,63.34 76.12,70.01 IDE.10
D12  (via drill 0.51)
  Top 0.305: IC4.6 v81.84,37.62 | v81.84,57.31 IC3.15
  Bottom 0.305: v81.84,37.62 v81.84,57.31 81.84,61.75 73.58,70.01 IDE.12
D13  (via drill 0.51)
  Top 0.305: v80.88,58.58 IC3.14 | IC4.7 v80.88,36.35
  Bottom 0.305: v80.88,36.35 v80.88,58.58 80.88,60.17 71.04,70.01 IDE.14
D14  (via drill 0.51)
  Top 0.305: IC4.8 77.39,35.08 76.76,35.72 v76.76,59.85 IC3.13
  Bottom 0.305: IDE.16 68.5,70.01 76.76,61.75 v76.76,59.85
D15  (via drill 0.51)
  Top 0.305: IC3.12 v75.8,61.12 75.72,34.37 76.28,33.81 IC4.9
  Bottom 0.305: IDE.18 65.96,70.01 74.85,61.12 v75.8,61.12
DMARQ
  Top 0.305: IDE.21 60.88,77.41 R4.2
GND  (via drill 0.51)
  Bottom 0.813: ST1.B1 78.66,9.68 | ST1.B31 2.46,9.05
  other vias: 12.94,61.12 22.15,59.21 86.6,62.39 78.66,31.27 81.84,16.67 1.83,10.95 1.83,25.56 41.83,16.67 30.4,17.94 18.34,17.3 57.71,52.23 48.18,51.59 46.28,55.4 79.77,45.56 98.42,61.12 81.91,10.95 8.81,70.64 22.15,64.93 75.33,64.45 70.88,60.01 21.83,71.76 13.89,67.47 20.88,78.26
  pour Top: -0.08,79.53 105.97,79.53 105.97,8.41 -0.08,8.41
  pour Bottom: -0.08,79.53 106.6,79.53 106.6,8.41 -0.08,8.41
INTRQ  (via drill 0.51)
  Top 0.254: v50.09,55.4 50.09,53.5 57.71,45.88 57.71,38.89 58.98,37.62
  Top 0.305: JP3.2 59.61,36.99 58.98,37.62
  Bottom 0.305: JP3.2 JP3.4 JP3.6 JP3.8 JP3.10 | IDE.31 48.82,73.18 49.45,72.55 49.45,61.12 50.09,60.48 v50.09,55.4
IORDY
  Top 0.305: IDE.27 53.26,77.41 R5.2
IRQ2  (via drill 0.51)
  Top 0.305: v59.61,21.75 58.98,21.75 57.07,23.65 JP3.9
  Bottom 0.305: ST1.B4 71.04,7.78 60.88,17.94 60.88,21.11 60.25,21.75 v59.61,21.75
IRQ3
  Bottom 0.305: ST1.B25 17.7,8.41 22.78,13.49 47.55,13.49 52.63,18.57 52.63,34.45 53.9,35.72 JP3.1
IRQ4
  Bottom 0.305: ST1.B24 20.24,8.41 24.69,12.86 48.18,12.86 53.26,17.94 53.26,32.54 53.9,33.18 JP3.3
IRQ5
  Bottom 0.305: ST1.B23 22.78,8.41 26.59,12.22 48.82,12.22 53.9,17.3 53.9,30 54.53,30.64 JP3.5
IRQ7
  Bottom 0.305: ST1.B21 27.86,8.41 31.04,11.59 49.45,11.59 54.53,16.67 54.53,27.46 55.17,28.1 JP3.7
JTAG-TCK  (via drill 0.51)
  Top 0.305: v14.53,62.39 18.34,62.39 18.97,61.75 18.97,60.48 18.53,60.04 IC6.11
  Bottom 0.305: JP6.3 7.54,76.36 8.18,75.72 13.26,75.72 15.16,73.82 15.16,63.02 v14.53,62.39
JTAG-TDI  (via drill 0.51)
  Top 0.305: v16.43,61.12 16.93,60.62 IC6.9
  Bottom 0.305: JP6.5 13.26,76.99 15.8,74.45 15.8,61.75 v16.43,61.12
JTAG-TDO  (via drill 0.51)
  Top 0.305: 17.7,70.65 v17.7,68.74 | 17.7,70.65 17.7,70.7 | IC6.24 17.7,70.65
  Bottom 0.305: JP6.4 10.08,77.63 10.72,78.26 17.07,78.26 17.7,77.63 v17.7,68.74
JTAG-TMS  (via drill 0.51)
  Top 0.305: 17.7,59.21 17.73,59.19 | 17.7,59.21 v17.7,61.12 | IC6.10 17.7,59.21
  Bottom 0.305: JP6.6 15.8,76.99 16.43,76.36 16.43,62.39 v17.7,61.12
N$1
  Top 0.305: IC2.1 51.36,24.92 R1.1 51.46,23.02 52.63,23.02 57.71,17.94 61.52,17.94 62.15,18.57 JP1.1
N$2
  Top 0.305: R9.1 53.9,28.1 53.26,27.46 IC2.3
N$3
  Top 0.305: R8.1 52.21,38.68 53.26,37.62 53.26,30.64 52.63,30 IC2.5
N$4
  Top 0.305: JP4.2 30.4,68.74 32.94,68.74 33.92,67.76 R6.1
N$5
  Top 0.305: R7.2 25.54,76.35 LED1.A
N$6
  Top 0.305: R10.2 25.54,72.13 27.23,73.82 JP7.1
PC-DB0  (via drill 0.51)
  Top 0.305: v76.76,26.83 IC5.2 | v68.18,47.78 v68.18,26.83 68.18,16.35 64.06,12.22 62.79,12.22 58.34,7.78 ST1.A9
  Bottom 0.305: 53.9,44.61 IC1.11 53.9,45.24 56.44,47.78 v68.18,47.78 | v68.18,26.83 v76.76,26.83
PC-DB1  (via drill 0.51)
  Top 0.305: v76.76,25.56 IC5.3 | v69.14,46.83 v69.14,25.56 69.14,16.03 60.88,7.78 ST1.A8
  Bottom 0.305: v69.14,46.83 58.02,46.83 56.44,45.24 IC1.12 | v69.14,25.56 v76.76,25.56
PC-DB2  (via drill 0.51)
  Top 0.305: v76.76,24.29 IC5.4 | v70.09,45.88 v70.09,24.29 70.09,14.45 63.42,7.78 ST1.A7
  Bottom 0.305: v70.09,45.88 59.61,45.88 58.98,45.24 IC1.13 | v70.09,24.29 v76.76,24.29
PC-DB3  (via drill 0.51)
  Top 0.305: v76.76,23.02 IC5.5 | v71.04,57.31 v71.04,23.02 71.04,12.86 65.96,7.78 ST1.A6
  Bottom 0.305: v71.04,57.31 62.15,57.31 61.52,57.94 IC1.15 | v71.04,23.02 v76.76,23.02
PC-DB4  (via drill 0.51)
  Top 0.305: v76.76,21.75 IC5.6 | v71.99,56.36 v71.99,21.75 71.99,11.27 68.5,7.78 ST1.A5
  Bottom 0.305: v71.99,56.36 60.56,56.36 58.98,57.94 IC1.16 | v71.99,21.75 v76.76,21.75
PC-DB5  (via drill 0.51)
  Top 0.305: v76.76,20.48 IC5.7 | v72.95,55.4 v72.95,20.48 72.95,9.68 71.04,7.78 ST1.A4
  Bottom 0.305: v72.95,55.4 58.98,55.4 56.44,57.94 IC1.17 | v72.95,20.48 v76.76,20.48
PC-DB6  (via drill 0.51)
  Top 0.305: v76.76,19.21 IC5.8 | v73.9,54.45 v73.9,19.21 73.9,8.41 73.58,8.1 ST1.A3
  Bottom 0.305: IC1.18 53.9,57.94 57.39,54.45 v73.9,54.45 | v73.9,19.21 v76.76,19.21
PC-DB7  (via drill 0.51)
  Top 0.305: 74.85,17.94 74.85,9.05 76.12,7.78 ST1.A2 | 74.85,17.94 v74.85,53.5 | 74.85,17.94 IC5.9
  Bottom 0.305: IC1.19 51.36,57.94 55.8,53.5 v74.85,53.5
RESDRV  (via drill 0.51)
  Top 0.305: v67.23,29.05 67.23,63.66 64.69,66.2 55.8,66.2 54.53,64.93 24.05,64.93 23.1,63.98 21.51,63.98 21.36,64.13 IC6.16
  Bottom 0.305: ST1.B2 76.12,10.32 80.57,14.76 80.57,28.73 80.25,29.05 v67.23,29.05
ROM_CS  (via drill 0.51)
  Top 0.305: v39.29,26.19 IC2.19 | IC1.20 48.82,56.04 39.93,47.15 39.93,42.7 39.29,42.07 v39.29,36.35
  Bottom 0.305: v39.29,26.19 v39.29,36.35
ROM_WR
  Top 0.305: R2.1 31.04,55.09 IC1.27 31.04,60.48 32.94,62.39 57.71,62.39 58.34,63.02 JP2.1
S1  (via drill 0.51)
  Top 0.305: IC6.1 10.53,57.12 v8.18,54.77 | v89.46,29.37 90.09,29.37 90.73,28.73 90.73,27.46 90.09,26.83 IC5.19
  Bottom 0.305: v8.18,54.77 10.08,52.86 52.63,52.86 56.44,49.05 73.58,49.05 78.03,44.61 78.03,36.35 79.93,34.45 87.31,34.45 88.58,33.18 88.58,30.24 v89.46,29.37
S2
  Top 0.305: IC6.18 21.04,65.73 21.75,66.44 24.05,66.44 24.29,66.2 53.26,66.2 54.53,67.47 82.47,67.47 85.01,64.93 85.01,55.4 86.92,53.5 86.92,51.59 87.55,50.96 IC3.1
S3  (via drill 0.51)
  Top 0.305: IC6.19 18.67,66.53 v18.34,66.2 | v23.42,65.56 53.9,65.56 55.17,66.83 71.68,66.83 76.12,62.39 IC3.11
  Bottom 0.305: v18.34,66.2 22.78,66.2 v23.42,65.56
S4  (via drill 0.51)
  Top 0.305: IC6.43 9.79,61.73 10.08,61.44 10.08,60.48 9.13,59.53 v9.13,57.63 | v78.66,46.51 78.66,44.02 IC4.1
  Bottom 0.305: v78.66,46.51 74.85,50.32 57.07,50.32 53.26,54.13 11.35,54.13 9.13,56.36 v9.13,57.63
S5  (via drill 0.51)
  Top 0.305: IC6.44 8.3,60.93 7.94,60.56 v7.94,56.67 | v89.46,31.27 89.46,32.54 89.4,32.49 88.82,32.49 IC4.11
  Bottom 0.305: v7.94,56.67 7.94,56.44 10.87,53.5 52.94,53.5 56.75,49.69 74.22,49.69 78.66,45.24 78.66,36.99 80.57,35.08 87.55,35.08 89.46,33.18 v89.46,31.27
VCC  (via drill 0.51)
  Top 0.305: IC2.20 41.2,24.92 C5.2 41.2,23.02 | v51.36,19.84 R1.2 | v55.8,40.48 54,40.48 R9.2 53.79,40.48 51.36,40.48 | 51.36,40.48 R8.2 | 51.36,40.48 51.36,40.64 | v24.69,73.18 23.73,73.18 | 23.73,73.18 23.73,74.99 R7.1 | R10.1 23.73,71.28 23.73,73.18 | v78.66,49.05 78.66,50.91 IC3.20
  Top 0.406: 16.13,65.23 v18.03,63.33 IC6.15 | 16.13,65.23 IC6.26 | IC6.35 9.9,68.13 12.79,65.23 16.13,65.23
  Top 0.61: IC3.20 84.59,50.96 C4.2 C3.2 84.59,43.97 86.92,43.97 | 86.92,43.97 IC4.20 | v86.92,30.32 86.92,43.97 | 86.92,28.1 IC5.20 | v86.92,30.32 86.92,28.1 | v86.92,30.32 C1.2 | v77.39,13.49 86.92,13.49 86.92,28.1 | IC1.28 C7.2 25.32,59.21 25.32,57.63 23.73,56.04 23.73,55.19 R2.2 23.73,55.09 v23.73,40.8 | v41.2,39.53 C2.+ | 39.29,23.02 v39.29,24.92 | 39.29,23.02 41.09,23.02 C5.2 | v16.43,26.19 16.43,24.92 19.95,21.41 RN3.1 RN3.2 RN3.3 RN3.4 RN2.2 | RN2.2 RN2.3 RN2.4 37.68,21.41 39.29,23.02 | RN2.2 RN2.1
  Bottom 0.305: 51.36,39.53 v51.36,19.84 | 55.8,39.53 v55.8,40.48 | v78.66,49.05 78.66,55.4 IDE.20
  Bottom 0.406: JP6.1 2.46,78.26 3.1,78.9 17.7,78.9 18.34,78.26 18.34,72.55 20.24,70.64 24.69,70.64 | 24.69,70.64 v24.69,73.18 | JP4.1 24.69,69.37 24.69,70.64 | v18.03,63.33 26.59,63.33 26.59,63.02
  Bottom 0.61: ST1.B29 7.54,26.19 v16.43,26.19 | v23.73,40.8 41.2,40.8 v41.2,39.53 | v86.92,30.32 86.92,32.54 62.15,32.54 62.15,39.53 55.8,39.53 51.36,39.53 v41.2,39.53 | v41.2,39.53 41.2,24.92 v39.29,24.92 | IC1.28 26.59,59.21 26.59,63.02 JP4.1
  Bottom 0.813: ST1.B3 73.58,13.49 v77.39,13.49

### Text on the board
tPlace: + | Ian Lesnet | I+S 2010 | v.trocio | XT-IDE ADAPTER v1b | DangerousPrototypes.com | Fulfillment by: | CC-BY_SA | Seeed studio | AUG 2011 | www.seeedstudio.com
bPlace: Memory Address | IO RANGE | DIP_SW 5:8 | DIP_SW 1:4 | 5678 | 1234 | 1111 = C0000 - C1FFF | 1111 = 200h | 1110 = C4000 - C5FFF | 1110 = 220h | 1101 = C8000 - C9FFF | 1101 = 240h | 1100 = CC000 - CDFFF | 1100 = 260h | 1011 = D0000 - D1FFF* | 1011 = 280h | 1010 = D4000 - D5FFF | 1010 = 2A0h | 1001 = D8000 - D9FFF | 1001 = 2C0h | 1000 = DC000 - DDFFF | 1000 = 2E0h | 0111 = E0000 - E1FFF | 0111 = 300h* | 0110 = E4000 - E5FFF | 0110 = 320h | 0101 = E8000 - E9FFF | 0101 = 340h | 0100 = EC000 - EDFFF | 0100 = 360h | 0011 = F0000 - F1FFF | 0011 = 380h | 0010 = F4000 - F5FFF | 0010 = 3A0h | 0001 = F8000 - F9FFF | 0001 = 3C0h | 0000 = FC000 - FDFFF | 0000 = 3E0h | *Default Setting | 1 = ON | 0 = OFF
tNames: VCC | GND | TCK | TDO | TDI | TMS | JTAG | WRITE ENABLE | WRITE DISABLE | IRQ SELECT | IRQ3 | IRQ4 | IRQ5 | IRQ7 | IRQ2 | ROM ENABLE | ROM DISABLE
Reference: HDD-LED | CSEL = VCC | CSEL = GND | XT-IDE ADAPTER | CC-BY-SA v1b | http://dangerousprototypes.com